# Altium project Strain Gauges OpAmps.PrjPcb
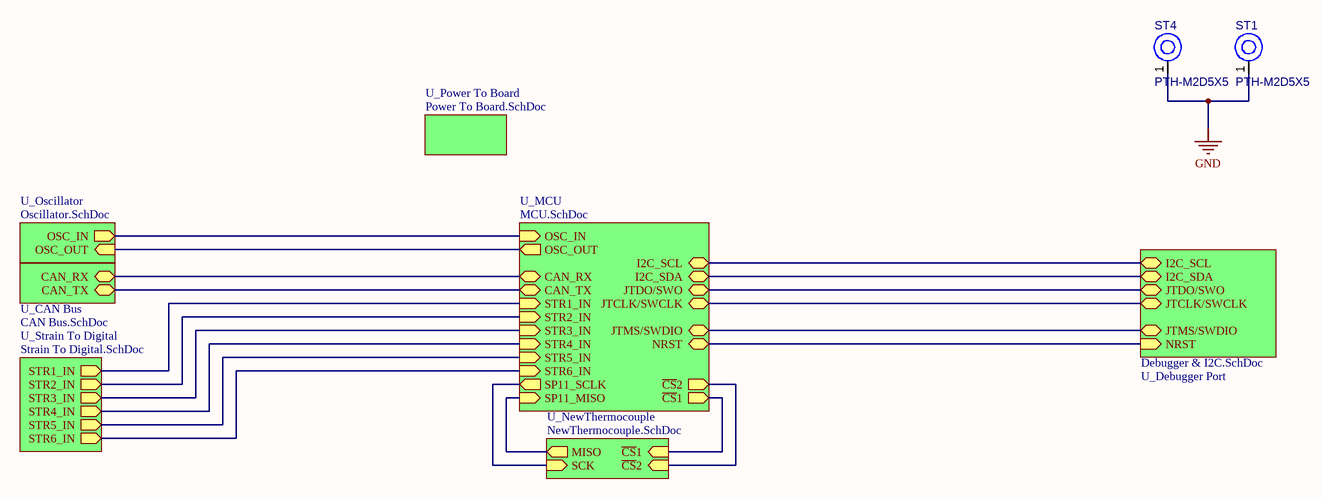
[diagram p0: Top.SchDoc]
9 sheets, 109 parts. Net scope: hierarchical (ports join the sheet entries above them; power ports are global).
Board file: Strain.PcbDoc
Sheets:
  Top.SchDoc
    U_Power To Board = Power To Board.SchDoc
    U_MCU = MCU.SchDoc
    U_Oscillator = Oscillator.SchDoc
    U_CAN Bus = CAN Bus.SchDoc
    U_Debugger Port = Debugger & I2C.SchDoc
    U_Strain To Digital = Strain To Digital.SchDoc
      U_Strain In = Strain In.SchDoc
    U_NewThermocouple = NewThermocouple.SchDoc

## Sheet Top.SchDoc
size A4; SheetNumber: 2; SheetTotal: 10

### Parts
ST1  PTH-M2D5X5  [PTH-M2D5X5]
ST4  PTH-M2D5X5  [PTH-M2D5X5]

### Sub-sheets
U_CAN Bus = CAN Bus.SchDoc: CAN_RX (bidir), CAN_TX (bidir)
U_Debugger Port = Debugger & I2C.SchDoc: JTDO/SWO (bidir), JTCLK/SWCLK (bidir), JTMS/SWDIO (bidir), NRST (in), I2C_SDA (bidir), I2C_SCL (bidir)
U_MCU = MCU.SchDoc: I2C_SDA (bidir), I2C_SCL (bidir), JTMS/SWDIO (bidir), JTCLK/SWCLK (bidir), JTDO/SWO (bidir), NRST (bidir), OSC_OUT (out), OSC_IN (in), SP11_SCLK (out), SP11_MISO (in), CAN_RX (bidir), CAN_TX (bidir), STR2_IN (in), STR3_IN (in), STR5_IN (in), STR1_IN (in), STR6_IN (in), STR4_IN (in), ~{CS}2 (out), ~{CS}1 (out)
U_NewThermocouple = NewThermocouple.SchDoc: ~{CS}1 (in), ~{CS}2 (in), MISO (out), SCK (in)
U_Oscillator = Oscillator.SchDoc: OSC_IN (out), OSC_OUT (in)
U_Power To Board = Power To Board.SchDoc: no entries
U_Strain To Digital = Strain To Digital.SchDoc: STR1_IN (out), STR2_IN (out), STR4_IN (out), STR5_IN (out), STR3_IN (out), STR6_IN (out)

### Nets
GND: ST1.1(H1) ST4.1(H1)
~{CS}1: sheet U_MCU/~{CS}1, sheet U_NewThermocouple/~{CS}1
~{CS}2: sheet U_MCU/~{CS}2, sheet U_NewThermocouple/~{CS}2
CAN_RX: sheet U_MCU/CAN_RX, sheet U_CAN Bus/CAN_RX
CAN_TX: sheet U_MCU/CAN_TX, sheet U_CAN Bus/CAN_TX
I2C_SCL: sheet U_MCU/I2C_SCL, sheet U_Debugger Port/I2C_SCL
I2C_SDA: sheet U_MCU/I2C_SDA, sheet U_Debugger Port/I2C_SDA
JTCLK/SWCLK: sheet U_MCU/JTCLK/SWCLK, sheet U_Debugger Port/JTCLK/SWCLK
JTDO/SWO: sheet U_MCU/JTDO/SWO, sheet U_Debugger Port/JTDO/SWO
JTMS/SWDIO: sheet U_MCU/JTMS/SWDIO, sheet U_Debugger Port/JTMS/SWDIO
MISO: sheet U_MCU/SP11_MISO, sheet U_NewThermocouple/MISO
NRST: sheet U_MCU/NRST, sheet U_Debugger Port/NRST
OSC_IN: sheet U_MCU/OSC_IN, sheet U_Oscillator/OSC_IN
OSC_OUT: sheet U_MCU/OSC_OUT, sheet U_Oscillator/OSC_OUT
SCK: sheet U_MCU/SP11_SCLK, sheet U_NewThermocouple/SCK
STR1_IN: sheet U_MCU/STR1_IN, sheet U_Strain To Digital/STR1_IN
STR2_IN: sheet U_MCU/STR2_IN, sheet U_Strain To Digital/STR2_IN
STR3_IN: sheet U_MCU/STR3_IN, sheet U_Strain To Digital/STR3_IN
STR4_IN: sheet U_MCU/STR4_IN, sheet U_Strain To Digital/STR4_IN
STR5_IN: sheet U_MCU/STR5_IN, sheet U_Strain To Digital/STR5_IN
STR6_IN: sheet U_MCU/STR6_IN, sheet U_Strain To Digital/STR6_IN

### Library data of the parts
ST1 ST4 = CMP-00028-00004-1: M2 PTH (2.5mm), 5mm pad; Pins: 1

## Sheet Power To Board.SchDoc
size A4; SheetNumber: 6; SheetTotal: 9
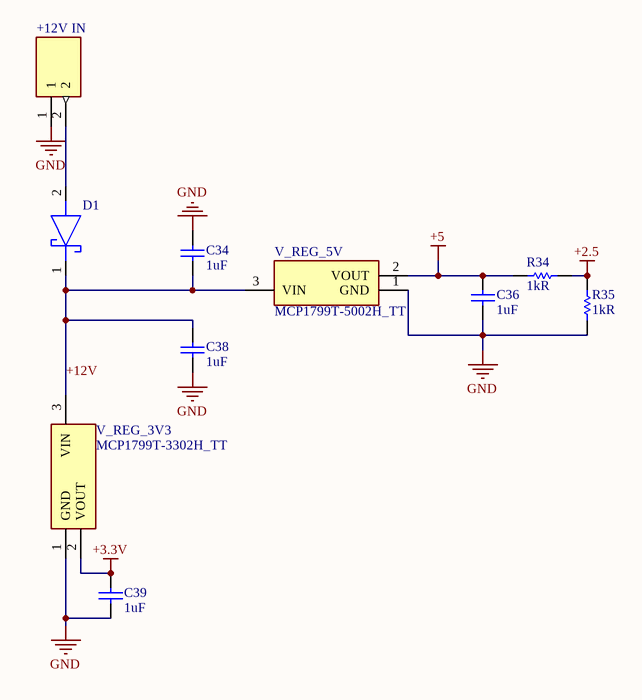
[diagram p1: Power To Board.SchDoc]

### Parts
+12V_IN  39773-0002  [397730002]  (value not drawn)
C34  1uF  [CAPC1608X90X35LL15T15]
C36  1uF  [CAPC1608X90X35LL15T15]
C38  1uF  [CAPC1608X90X35LL15T15]
C39  1uF  [CAPC1608X90X35LL15T15]
D1  NSR20F20NXT5G  [NSR20F20NXT5G]  (value not drawn)
R34  1kR  [RESC1608X55X30LL15T15]
R35  1kR  [RESC1608X55X30LL15T15]
V_REG_3V3  MCP1799T-3302H_TT  [SOT95P237X112-3N]
V_REG_5V  MCP1799T-5002H_TT  [SOT95P237X112-3N]

### Nets
+2.5: R34.1 R35.1
+3.3V: C39.2 V_REG_3V3.2(VOUT)
+5: C36.2 R34.2 V_REG_5V.2(VOUT)
GND: +12V_IN.1 C34.2 C36.1 C38.1 C39.1 R35.2 V_REG_3V3.1(GND) V_REG_5V.1(GND)
+12V: C34.1 C38.2 D1.1(K) V_REG_3V3.3(VIN) V_REG_5V.3(VIN)
Net+12V_IN_2: +12V_IN.2 D1.2(A)

### Library data of the parts
+12V_IN = 39773-0002: Connector; Manufacturer_Name: Molex; Datasheet Link: https://www.mouser.in/datasheet/2/276/2/397730002_sd-1378779.pdf; Height: 10.1mm; Manufacturer_Part_Number: 39773-0002
C34 C36 C38 C39 = CMP-2006-02298-2: Manufacturer: Kemet; Part Number: C0603C105K4RACTU
D1 = NSR20F20NXT5G: Schottky Diode; Manufacturer_Name: ON Semiconductor; Datasheet Link: https://www.onsemi.com/pdf/datasheet/nsr20f20-d.pdf; Height: 0.31mm; Manufacturer_Part_Number: NSR20F20NXT5G
R34 R35 = CMP-2000-00180-1: Part Number: ERJ-3EKF1001V; Manufacturer: Panasonic
V_REG_3V3 = MCP1799T-3302H_TT: Power Supply; Manufacturer_Name: Microchip; Manufacturer_Part_Number: MCP1799T-3302H/TT; Datasheet Link: https://ms.componentsearchengine.com/Datasheets/1/MCP1799T-3302H_TT.pdf; Height: 1.12mm
V_REG_5V = MCP1799T-5002H_TT: Integrated Circuit; Manufacturer_Name: Microchip; Manufacturer_Part_Number: MCP1799T-5002H/TT; Datasheet Link: https://www.arrow.com/en/products/mcp1799t-5002htt/microchip-technology; Height: 1.12mm

## Sheet MCU.SchDoc
size A4; SheetNumber: 4; SheetTotal: 9
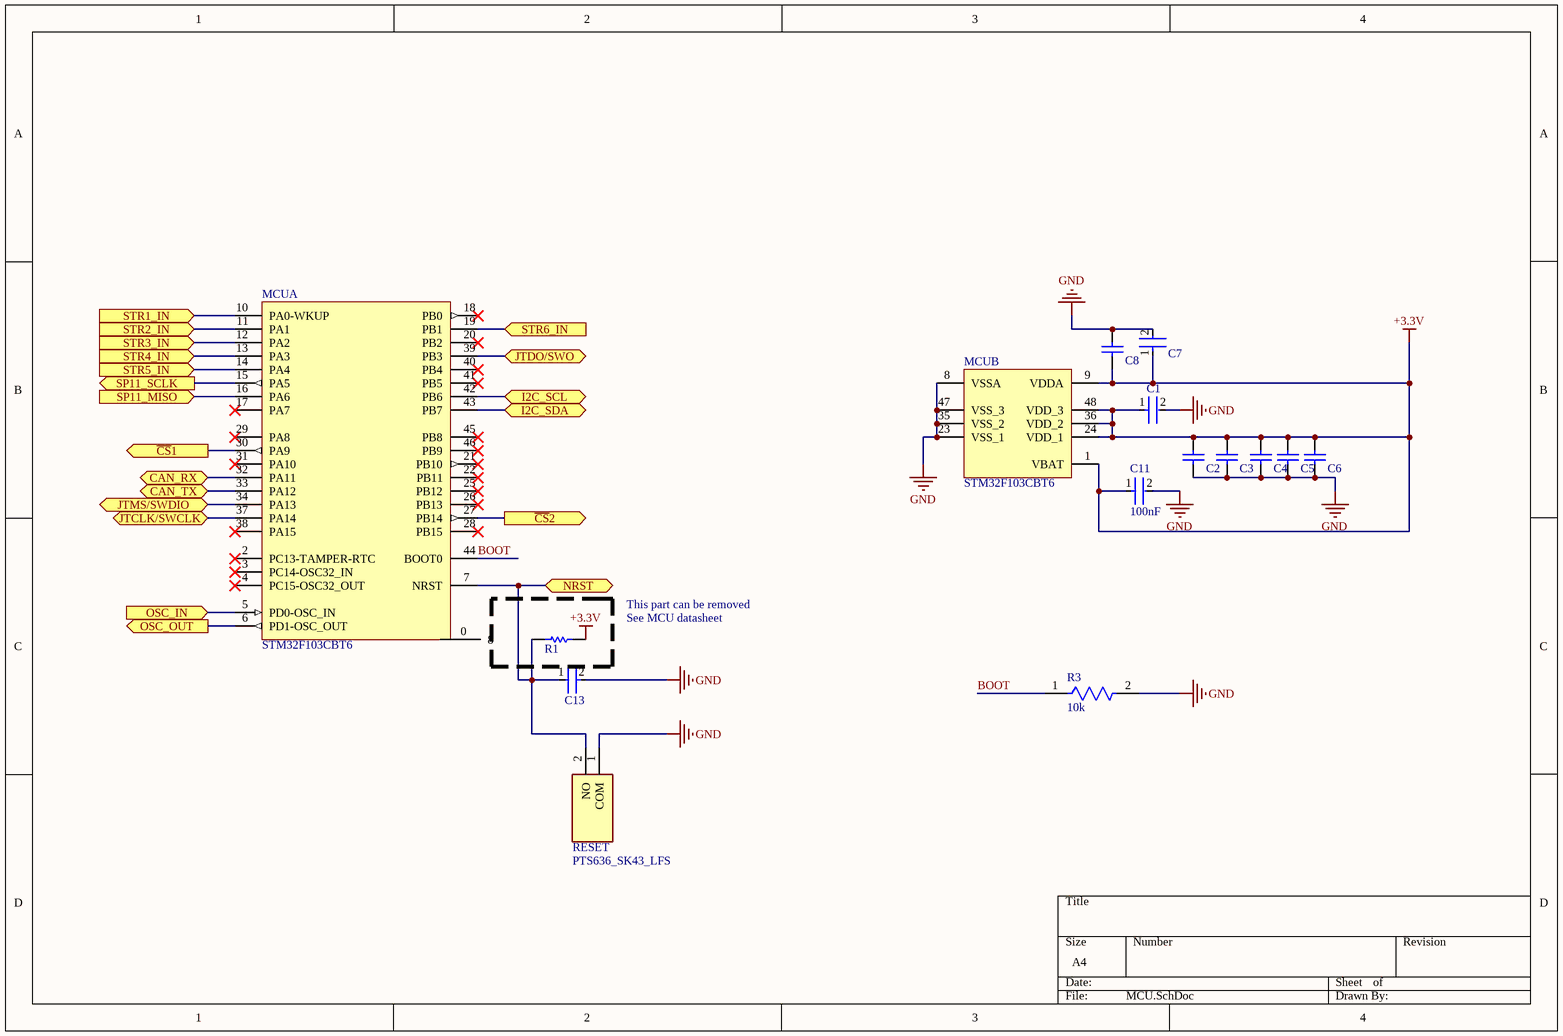
[diagram p2: MCU.SchDoc]

### Parts
C1  GRM155R60J475ME47D  [FP-GRM155-0_1-IPC_B]  (value not drawn)
C2  08051C104KAT2A  [CAPC2013X94X50ML20T25]  (value not drawn)
C3  08051C104KAT2A  [CAPC2013X94X50ML20T25]  (value not drawn)
C4  08051C104KAT2A  [CAPC2013X94X50ML20T25]  (value not drawn)
C5  08051C104KAT2A  [CAPC2013X94X50ML20T25]  (value not drawn)
C6  08051C104KAT2A  [CAPC2013X94X50ML20T25]  (value not drawn)
C7  GRM155R61A105KE15D  [FP-GRM15-0_1-MFG]  (value not drawn)
C8  08051C104KAT2A  [CAPC2013X94X50ML20T25]  (value not drawn)
C11  100nF  [FP-C0402-BB-MFG]
C13  GRM155R71C104KA88D  [FP-GRM15-MFG]  (value not drawn)
MCU  STM32F103CBT6  [STM-LQFP48_L]  (parts A,B of 2)
R1  CRCW12064K70FKEA  [RESC3216X60X45ML15T20]  (value not drawn)
R3  10k  [FP-CRCW0402-e3-IPC_B]
RESET  PTS636_SK43_LFS  [PTS636SK43LFS]

### Ports
CAN_RX (bidir), CAN_TX (bidir), I2C_SCL (bidir), I2C_SDA (bidir), JTCLK/SWCLK (bidir), JTDO/SWO (bidir), JTMS/SWDIO (bidir), NRST (bidir), OSC_IN (in), OSC_OUT (out), SP11_MISO (in), SP11_SCLK (out), STR1_IN (in), STR2_IN (in), STR3_IN (in), STR4_IN (in), STR5_IN (in), STR6_IN (in), ~{CS}1 (out), ~{CS}2 (out)

### Nets
+3.3V: C1.1 C2.2 C3.2 C4.2 C5.2 C6.2 C7.1 C8.2 C11.1 MCU.1(VBAT) MCU.9(VDDA) MCU.24(VDD_1) MCU.36(VDD_2) MCU.48(VDD_3) R1.2
GND: C1.2 C2.1 C3.1 C4.1 C5.1 C6.1 C7.2 C8.1 C11.2 C13.2 MCU.8(VSSA) MCU.23(VSS_1) MCU.35(VSS_2) MCU.47(VSS_3) R3.2 RESET.1(COM)
~{CS}1: MCU.30(PA9) ; port ~{CS}1
~{CS}2: MCU.27(PB14) ; port ~{CS}2
BOOT: MCU.44(BOOT0) R3.1
CAN_RX: MCU.32(PA11) ; port CAN_RX
CAN_TX: MCU.33(PA12) ; port CAN_TX
I2C_SCL: MCU.42(PB6) ; port I2C_SCL
I2C_SDA: MCU.43(PB7) ; port I2C_SDA
JTCLK/SWCLK: MCU.37(PA14) ; port JTCLK/SWCLK
JTDO/SWO: MCU.39(PB3) ; port JTDO/SWO
JTMS/SWDIO: MCU.34(PA13) ; port JTMS/SWDIO
MISO: MCU.16(PA6) ; port SP11_MISO
NRST: C13.1 MCU.7(NRST) R1.1 RESET.2(NO) ; port NRST
OSC_IN: MCU.5(PD0-OSC_IN) ; port OSC_IN
OSC_OUT: MCU.6(PD1-OSC_OUT) ; port OSC_OUT
SCK: MCU.15(PA5) ; port SP11_SCLK
STR1_IN: MCU.10(PA0-WKUP) ; port STR1_IN
STR2_IN: MCU.11(PA1) ; port STR2_IN
STR3_IN: MCU.12(PA2) ; port STR3_IN
STR4_IN: MCU.13(PA3) ; port STR4_IN
STR5_IN: MCU.14(PA4) ; port STR5_IN
STR6_IN: MCU.19(PB1) ; port STR6_IN

Not connected (* = marked no-connect by the designer): MCU 0(8) 2(PC13-TAMPER-RTC)* 3(PC14-OSC32_IN)* 4(PC15-OSC32_OUT)* 17(PA7)* 18(PB0)* 20(PB2)* 21(PB10)* 22(PB11)* 25(PB12)* 26(PB13)* 28(PB15)* 29(PA8)* 31(PA10)* 38(PA15)* 40(PB4)* 41(PB5)* 45(PB8)* 46(PB9)*

### Notes on the sheet
- This part can be removed
- See MCU datasheet

### Library data of the parts
C1 = CMP-2008-04549-2: Chip Multilayer Ceramic Capacitors for General Purpose, 0402, 4.7uF, X5R, 15%, 20%, 6.3V; Height: 0.5mm; Weight: 0.000212oz; Length: 1mm; Case Code (Metric): 1005; Packaging: Tape and Reel; Termination: SMD/SMT; Dielectric: X5R; Depth: 0.5mm; Case Code (Imperial): 0402; Min Operating Temperature: -55°C; Case/Package: 0402; Voltage: 6.3V; Width: 0.02inch; Capacitance: 4.7uF; Lead Free: Lead Free; Thickness: 0.022inch; Contact Plating: Tin; REACH SVHC: No SVHC; Package Quantity: 10000; Tolerance: 20%; Voltage Rating (DC): 6.3V; Voltage Rating: 6.3V; Mount: Surface Mount; Max Operating Temperature: 85°C
C2-C6 C8 = CMP-2007-04174-1: Manufacturer: AVX Interconnect / Elco; Part Number: 08051C104KAT2A
C7 = CMP-2008-04556-2: CAP CER 1UF 10V X5R 0402; Manufacturer: Murata; Material: Ceramic; Tolerance: 10%; Temperature Coefficient: 15%; Octopart: https://octopart.com/grm155r61a105ke15d-murata-197442; Manufacturer Part Number: GRM155R61A105KE15D; Lead Free: Yes; ComponentLink2Description: Datasheet; Temperature: -55°C to +85°C; Temperature Range High: +85°C; Height: 0.55mm; Capacitance: 1uF; Ipc Land Pattern Name: CAPC10050X50; ComponentLink2URL: https://search.murata.co.jp/Ceramy/image/img/A01X/G101/ENG/GRM155R61A105KE15-01A.pdf; Temperature Range Low: -55°C; Device Class L2: Capacitors; Voltage Rating: 10V; RoHS: TRUE; Device Class L1: Passive Components; Device Class L3: Ceramic Capacitors; Temperature Characteristic: X5R; Mouser Description: 0402 1 uF 10 V ±10% Tolerance X5R Surface Mount Multilayer Ceramic Capacitor; Automotive: No; Package: GRM15-0.1; Digikey Description: CAP CER 1UF 10V X5R 0402; Value: 1uF; Category: Cap
C11 = CMP-2008-02046-2: CAP CER 0.1UF 10V X5R 0402; Manufacturer: Kemet; Manufacturer Part Number: C0402C104K8PACTU; Material: Ceramic; Capacitance: 0.10 μF; Temperature Coefficient: 15%; Tolerance: 0.1; Value: 0.10 μF; Package: C0402-BB; Temperature: -55°C to +125°C; ComponentLink2Description: Datasheet; Temperature Characteristic: X5R; Device Class L1: Passive Components; Height: 0.55mm; Lead Free: Yes; ComponentLink2URL: https://content.kemet.com/datasheets/KEM_C1002_X7R_SMD.pdf; Device Class L2: Capacitors; Temperature Range Low: -55°C; Temperature Range High: +125°C; RoHS: TRUE; Octopart: https://octopart.com/c0402c104k8pactu-kemet-140039; Automotive: No; Mouser Description: Capacitor 100 nF 10 VDC 0402; Category: Cap; Voltage Rating: 10 V; Digikey Description: CAP CER 0.1UF 10V X5R 0402; Ipc Land Pattern Name: CAPC10050X50; Device Class L3: Ceramic Capacitors
C13 = CMP-2100-03641-2: CAP CER 0.1UF 16V X7R 0402; Manufacturer: Murata; Standoff Height: 0mm; Tolerance: 10%; Voltage Rating: 16Vdc; Material: Ceramic; Capacitance: 0.10μF; Value: 0.10μF; RoHS: TRUE; Manufacturer Part Number: GRM155R71C104KA88D; Temperature Characteristic: X7R; Octopart: https://octopart.com/grm155r71c104ka88d-murata-196880; Digikey Description: CAP CER 0.1UF 16V X7R 0402; Device Class L3: Ceramic Capacitors; Height: 0.55mm; ComponentLink2Description: Datasheet; Temperature Range Low: -55°C; Ipc Land Pattern Name: CAPC10050X219; ComponentLink2URL: https://search.murata.co.jp/Ceramy/image/img/A01X/G101/ENG/GRM155R71H471KA01-01A.pdf; Device Class L1: Passive Components; Lead Free: yes; Category: Cap; Package: GRM15; Temperature: -55°C to +125°C; Device Class L2: Capacitors; Temperature Range High: +125°C; Mouser Description: 0402 0.1 uF 16V ±10 % Tolerance X7R SMT Multilayer Ceramic Capacitor
MCU = CMP-0237-00250-3: ARM Cortex-M3 32-bit MCU, 128 KB Flash, 20 KB Internal RAM, 37 I/Os, 48-pin LQFP, -40 to 85 degC, Tray; Supply Voltage(Vcc) min (V): 2; Operating Frequency(F) (Processor speed) (MHz): 72; A/D Converter: 2x12-bit (10 Channel); FLASH Size (Prog) (kB): 128; Internal RAM Size (kB): 20; I/Os (High Current): 37; ComponentLink2Description: Datasheet; PackageReference: LQFP48; PartNumber: STM32F103CBT6; ComponentLink1Description: Manufacturer URL; DatasheetVersion: Rev. 16; PackageVersion: Rev. 6, 06/2013; Packing: Tray; ComponentLink1URL: http://www.st.com/web/en/home.html; Mounting Technology: Surface Mount; ComponentLink3URL: http://www.st.com/st-web-ui/static/active/en/resource/technical/document/datasheet/DM00058181.pdf; PackageDescription: 48-Pin Low Profile Quad Flat Package, 7 x 7 mm Body, 0.5 mm Pitch; Core: ARM Cortex-M3; ComponentLink3Description: Package Specification; ComponentLink2URL: http://www.st.com/st-web-ui/static/active/en/resource/technical/document/datasheet/CD00161566.pdf
R1 = CMP-2100-03618-1: Chip Resistor, 4.7 KOhm, +/- 1%, 0.25 W, -55 to 155 degC, 1206 (3216 Metric), RoHS, Tape and Reel; Manufacturer: Vishay Semiconductor; Power Rating: 250mW; Voltage Rating: 200V; Temperature Coefficient: 100ppm/degreesC; Package Quantity: 10; Composition: ThickFilm; REACH SVHC: Unknown; Mount: SurfaceMount; Max Operating Temperature: 155degC; Length: 3.2mm; Number of Terminations: 2; Case Code (Metric): 3216; Military Standard: Not; Width: 1.6mm; Datasheet Version: 41061.0; Max Power Dissipation: 250mW; Datasheet URL: http://www.vishay.com/docs/20035/dcrcwe3.pdf; Contact Plating: Tin; Case/Package: 1206; Height: 0.55mm; Package Reference: 1206.0; Lead Free: LeadFree; Weight: 0.000353oz; Package Description: 2-Pin Surface Mount Device, Body 3.15 x 1.6 mm; Min Operating Temperature: -55degC; Resistance: 4.7KOhm; Packaging: TapeandReel; Depth: 1.6mm; Tolerance: 1%; RoHSCompliant: true; Termination: SMD/SMT; Case Code (Imperial): 1206; Voltage Rating (DC): 200V; Radiation Hardening: No; Manufacturer URL: http://www.vishay.com/
R3 = CMP-2002-08135-2: RES SMD 10K OHM 1% 1/16W 0402; Power Rating: 63mW; Resistance: 10kR; Voltage Rating: 50V; Temperature Coefficient: 100ppm/°C; Case Code (Metric): 1005; Features: Automotive AEC-Q200; Termination: SMD/SMT; Mount: Surface Mount; Package Quantity: 10; Packaging: Tape and Reel; Case Code (Imperial): 0402; Weight: 2.3E-05oz; Lead Free: Lead Free; Width: 0.02inch; Max Power Dissipation: 63mW; Tolerance: 1%; Number of Terminations: 2; Height: 0.35mm; Number of Pins: 2; Composition: Thick Film; Length: 1mm; Voltage Rating (DC): 50V; Case/Package: 0402; Radiation Hardening: No; Contact Plating: Tin; Depth: 0.5mm; Military Standard: Not; Min Operating Temperature: -55°C; Max Operating Temperature: 155°C
RESET = PTS636_SK43_LFS: Switch; Manufacturer_Name: C & K COMPONENTS; Manufacturer_Part_Number: PTS636 SK43 LFS; Datasheet Link: https://componentsearchengine.com/Datasheets/1/PTS636 SK43 LFS.pdf; Height: 4.5mm

## Sheet Oscillator.SchDoc
size A4; SheetNumber: 4; SheetTotal: 9
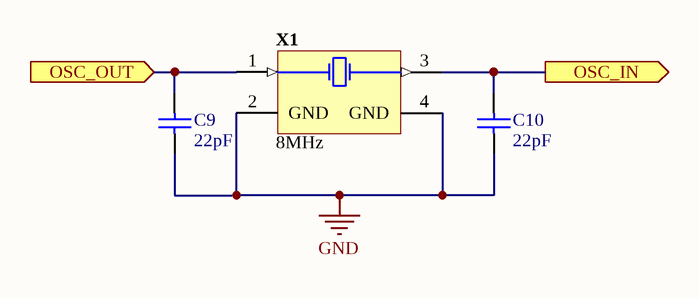
[diagram p3: Oscillator.SchDoc]

### Parts
C9  22pF  [CAPC1608X90X35ML10T15]
C10  22pF  [CAPC1608X90X35ML10T15]
X1  8MHz  [ABRA-ABM3B_V]

### Ports
OSC_IN (out), OSC_OUT (in)

### Nets
GND: C9.1 C10.1 X1.2(GND) X1.4(GND)
OSC_IN: C10.2 X1.3(X2) ; port OSC_IN
OSC_OUT: C9.2 X1.1(X1) ; port OSC_OUT

### Library data of the parts
C9 C10 = CMP-2000-04945-1: Chip Capacitor, 22 pF, +/- 5%, 50 V, -55 to 125 degC, 0603 (1608 Metric), RoHS, Tape and Reel; Manufacturer: Murata; Rated Voltage: 50V; Dielectric: C0G; Capacitance: 22pF; Manufacturer URL: http://www.murata.com/; Datasheet Version: Jul-06; Package Reference: 603; Tolerance (%): ±5%; Case Size/Dimension: 0603; Package Description: 2-Pin Surface Mount Device, Body 1.6 x 0.8 mm; Datasheet URL: https://datasheet.ciiva.com/11786/0900766b807a1cab-11786398.pdf
X1 = CMP-1688-00002-1: Ceramic SMD Crystal, 8 MHz, +/- 20 ppm, 200 Ohm, -20 to 70 degC, 4-Pin SMD, RoHS, Tape and Reel; Max Supply Voltage: 45 V; Outputs: 4; Min Supply Voltage: 8.2 V; Output Voltage: 3.3 V; Switching Frequency: 30 KHz; Output Current: 1.8 A; Packaging: Rail/Tube; ComponentLink2Description: Datasheet; REACH SVHC: No SVHC; ComponentLink1URL: http://www.abracon.com/; PackageReference: ABM3B; Weight: 0.004233 oz; Height: 1.05 mm; ComponentLink2URL: http://www.abracon.com/Resonators/abm3b.pdf; Mount: Surface Mount; Min Operating Temperature: -40 degC; Max Operating Temperature: 85 degC; Package Quantity: 50; PackageDescription: 4-Pin Surface Mount Device, Body 5 x 3.2 mm; Pins: 28; DatasheetVersion: Aug-15; ComponentLink1Description: Manufacturer URL; RoHSCompliant: true; Radiation Hardening: No; Length: 9.8 mm; Width: 4.5 mm

## Sheet CAN Bus.SchDoc
size A4; SheetNumber: 5; SheetTotal: 9
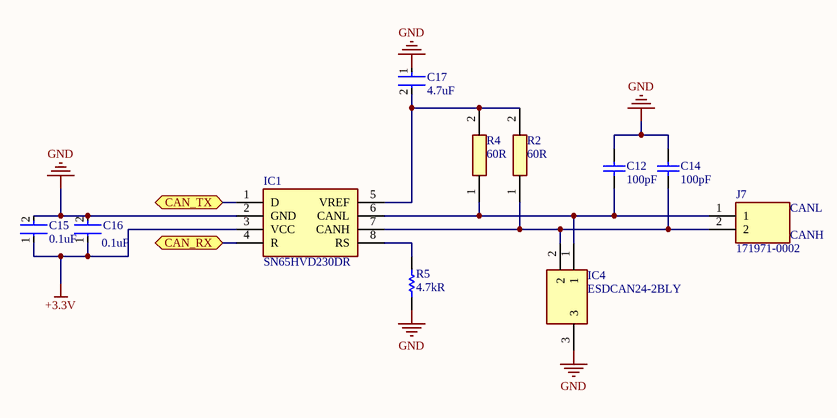
[diagram p4: CAN Bus.SchDoc]

### Parts
C12  100pF  [CAPC1608X90X35NL10T15]
C14  100pF  [CAPC1608X90X35NL10T15]
C15  0.1uF  [FP-GRM15-MFG]
C16  0.1uF  [FP-GRM15-MFG]
C17  4.7uF  [FP-GRM155-0_1-IPC_B]
IC1  SN65HVD230DR  [SOT127P600X175-8N]
IC4  ESDCAN24-2BLY  [SOT105P255X150-3N]
J7  171971-0002  [SHDR2W65P0X254_1X2_738X510X1216P]
R2  60R  [RESC3216X60N]
R4  60R  [RESC3216X60N]
R5  4.7kR  [RESC3216X60X45ML15T20]

### Ports
CAN_RX (bidir), CAN_TX (bidir)

### Nets
+3.3V: C15.1 C16.1 IC1.3(VCC)
GND: C12.2 C14.2 C15.2 C16.2 C17.1 IC1.2(GND) IC4.3 R5.1
CAN_RX: IC1.4(R) ; port CAN_RX
CAN_TX: IC1.1(D) ; port CAN_TX
NetC12_1: C12.1 IC1.6(CANL) IC4.1 J7.1 R4.1
NetC14_1: C14.1 IC1.7(CANH) IC4.2 J7.2 R2.1
NetC17_2: C17.2 IC1.5(VREF) R2.2 R4.2
NetIC1_8: IC1.8(RS) R5.2

### Notes on the sheet
- CANL
- CANH

### Library data of the parts
C12 C14 = CMP-2006-02595-1: Part Number: GRM1885C1H101JA01D; Manufacturer: Murata
C15 C16 = CMP-2100-03641-2: CAP CER 0.1UF 16V X7R 0402; Manufacturer Part Number: GRM155R71C104KA88D; Manufacturer: Murata; Standoff Height: 0mm; Tolerance: 10%; Voltage Rating: 16Vdc; Material: Ceramic; Capacitance: 0.10μF; Value: 0.10μF; RoHS: TRUE; Temperature Characteristic: X7R; Octopart: https://octopart.com/grm155r71c104ka88d-murata-196880; Digikey Description: CAP CER 0.1UF 16V X7R 0402; Device Class L3: Ceramic Capacitors; Height: 0.55mm; ComponentLink2Description: Datasheet; Temperature Range Low: -55°C; Ipc Land Pattern Name: CAPC10050X219; ComponentLink2URL: https://search.murata.co.jp/Ceramy/image/img/A01X/G101/ENG/GRM155R71H471KA01-01A.pdf; Device Class L1: Passive Components; Lead Free: yes; Category: Cap; Package: GRM15; Temperature: -55°C to +125°C; Device Class L2: Capacitors; Temperature Range High: +125°C; Mouser Description: 0402 0.1 uF 16V ±10 % Tolerance X7R SMT Multilayer Ceramic Capacitor
C17 = CMP-2008-04549-2: as C1 on sheet MCU; Height: 0.5mm; Weight: 0.000212oz; Length: 1mm; Case Code (Metric): 1005; Packaging: Tape and Reel; Termination: SMD/SMT; Dielectric: X5R; Depth: 0.5mm; Case Code (Imperial): 0402; Min Operating Temperature: -55°C; Case/Package: 0402; Voltage: 6.3V; Width: 0.02inch; Capacitance: 4.7uF; Lead Free: Lead Free; Thickness: 0.022inch; Contact Plating: Tin; REACH SVHC: No SVHC; Package Quantity: 10000; Tolerance: 20%; Voltage Rating (DC): 6.3V; Voltage Rating: 6.3V; Mount: Surface Mount; Max Operating Temperature: 85°C
IC1 = SN65HVD230DR: Integrated Circuit; Manufacturer_Name: Texas Instruments; Datasheet Link: http://www.ti.com/lit/gpn/sn65hvd230; Height: 1.75mm; Mouser2 Part Number: 595-SN65HVD230DR; Mouser2 Price/Stock: https://www.mouser.com/Search/Refine.aspx?Keyword=595-SN65HVD230DR; Manufacturer_Part_Number: SN65HVD230DR
IC4 = ESDCAN24-2BLY: Integrated Circuit; Manufacturer_Name: STMicroelectronics; Datasheet Link: https://componentsearchengine.com//ESDCAN24-2BLY.pdf; Height: 1.5mm; Mouser2 Part Number: 511-ESDCAN24-2BLY; Mouser2 Price/Stock: https://www.mouser.com/Search/Refine.aspx?Keyword=511-ESDCAN24-2BLY; Manufacturer_Part_Number: ESDCAN24-2BLY
J7 = 171971-0002: Connector; Manufacturer_Name: Molex; Datasheet Link: https://componentsearchengine.com//171971-0002.pdf; Height: 12.16mm; Mouser2 Part Number: 538-171971-0002; Mouser2 Price/Stock: https://www.mouser.com/Search/Refine.aspx?Keyword=538-171971-0002; Manufacturer_Part_Number: 171971-0002
R2 R4 = CRCW120660R0KNEAIF: Resistor; Manufacturer_Name: Vishay; Datasheet Link: http://componentsearchengine.com/Datasheets/1/CRCW120660R0KNEAIF.pdf; Height: 0.6mm; Manufacturer_Part_Number: CRCW120660R0KNEAIF
R5 = CMP-2100-03618-1: as R1 on sheet MCU; Package Quantity: 10; Composition: ThickFilm; REACH SVHC: Unknown; Mount: SurfaceMount; Max Operating Temperature: 155degC; Length: 3.2mm; Number of Terminations: 2; Case Code (Metric): 3216; Military Standard: Not; Width: 1.6mm; Datasheet Version: 41061.0; Max Power Dissipation: 250mW; Datasheet URL: http://www.vishay.com/docs/20035/dcrcwe3.pdf; Contact Plating: Tin; Case/Package: 1206; Height: 0.55mm; Package Reference: 1206.0; Lead Free: LeadFree; Weight: 0.000353oz; Package Description: 2-Pin Surface Mount Device, Body 3.15 x 1.6 mm; Min Operating Temperature: -55degC; Resistance: 4.7KOhm; Packaging: TapeandReel; Depth: 1.6mm; Tolerance: 1%; RoHSCompliant: true; Termination: SMD/SMT; Case Code (Imperial): 1206; Voltage Rating (DC): 200V; Radiation Hardening: No; Manufacturer URL: http://www.vishay.com/

## Sheet Debugger & I2C.SchDoc
size A4; SheetNumber: 6; SheetTotal: 9
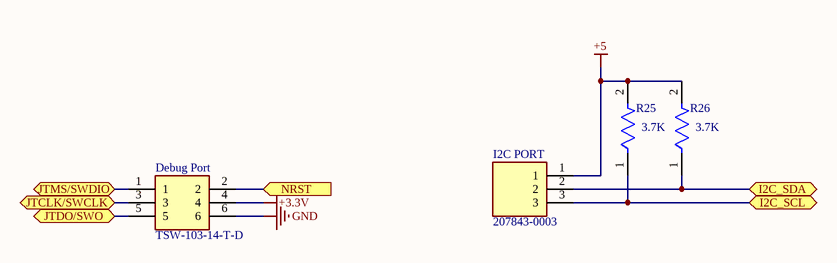
[diagram p5: Debugger & I2C.SchDoc]

### Parts
Debug_Port  TSW-103-14-T-D  [TSW-103-XX-YY-D]
I2C_PORT  207843-0003  [2078430003]
R25  3.7K  [FP-RN731J-MFG]
R26  3.7K  [FP-RN731J-MFG]

### Ports
I2C_SCL (bidir), I2C_SDA (bidir), JTCLK/SWCLK (bidir), JTDO/SWO (bidir), JTMS/SWDIO (bidir), NRST (in)

### Nets
+3.3V: Debug_Port.4
+5: I2C_PORT.1 R25.2 R26.2
GND: Debug_Port.6
I2C_SCL: I2C_PORT.3 R25.1 ; port I2C_SCL
I2C_SDA: I2C_PORT.2 R26.1 ; port I2C_SDA
JTCLK/SWCLK: Debug_Port.3 ; port JTCLK/SWCLK
JTDO/SWO: Debug_Port.5 ; port JTDO/SWO
JTMS/SWDIO: Debug_Port.1 ; port JTMS/SWDIO
NRST: Debug_Port.2 ; port NRST

### Library data of the parts
Debug_Port = TSW-103-14-T-D: Connector; Manufacturer_Name: SAMTEC; Datasheet Link: http://suddendocs.samtec.com/prints/tsw-xxx-xx-xxx-x-xx-xxx-mkt.pdf; Manufacturer_Part_Number: TSW-103-14-T-D
I2C_PORT = 207843-0003: Connector; Manufacturer_Name: Molex; Datasheet Link: https://www.molex.com/pdm_docs/sd/2078430003_sd.pdf; Height: 6.95mm; Manufacturer_Part_Number: 207843-0003
R25 R26 = CMP-04015-066978-1: 3.7kΩ ±0.25% 0.063W, 1/16W Chip Resistor 0603 (1608 Metric) Moisture Resistant Thin Film; Voltage Rating: 50V; Power Rating: 63mW; Temperature Coefficient: 10ppm/°C; Resistance: 3.7kR; Min Operating Temperature: -55°C; Packaging: Tape and Reel; Tolerance: 0.25%; Termination: SMD/SMT; Case/Package: 0603; Case Code (Metric): 1608; Case Code (Imperial): 0603; Composition: Thin Film; Max Operating Temperature: 125°C

## Sheet Strain To Digital.SchDoc
size A4; SheetNumber: 7; SheetTotal: 9
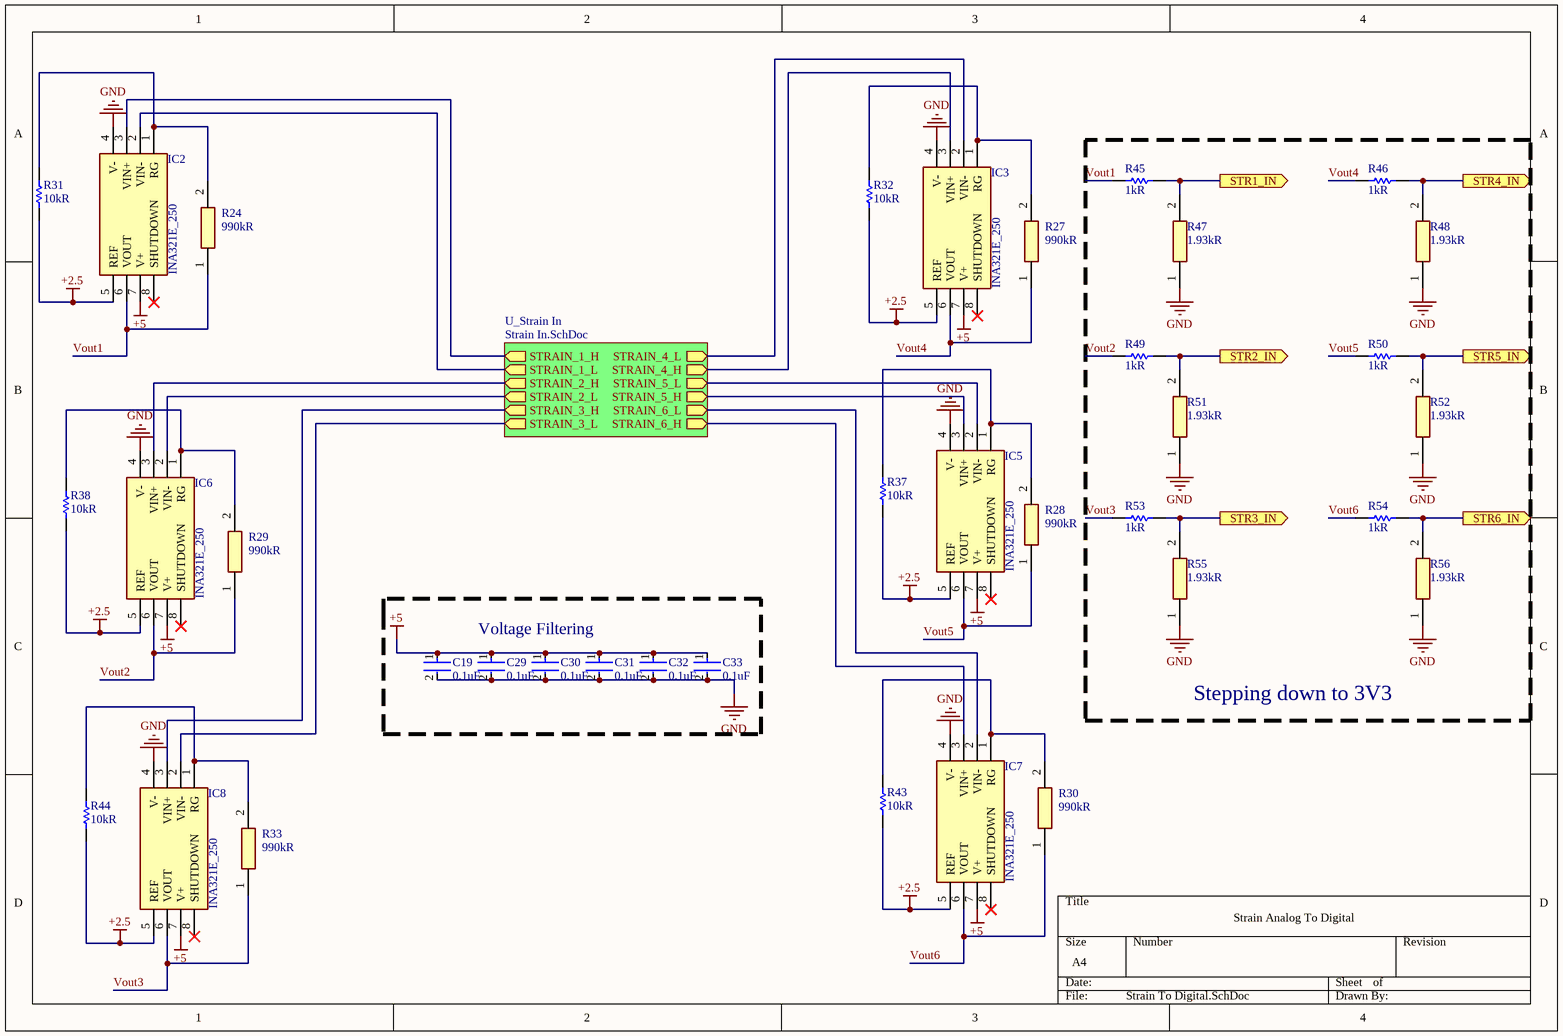
[diagram p6: Strain To Digital.SchDoc]

### Parts
C19  0.1uF  [FP-CC0402-MFG]
C29  0.1uF  [FP-CC0402-MFG]
C30  0.1uF  [FP-CC0402-MFG]
C31  0.1uF  [FP-CC0402-MFG]
C32  0.1uF  [FP-CC0402-MFG]
C33  0.1uF  [FP-CC0402-MFG]
IC2  INA321E_250  [SOP65P490X110-8N]
IC3  INA321E_250  [SOP65P490X110-8N]
IC5  INA321E_250  [SOP65P490X110-8N]
IC6  INA321E_250  [SOP65P490X110-8N]
IC7  INA321E_250  [SOP65P490X110-8N]
IC8  INA321E_250  [SOP65P490X110-8N]
R24  990kR  [RESC3216X84N]
R27  990kR  [RESC3216X84N]
R28  990kR  [RESC3216X84N]
R29  990kR  [RESC3216X84N]
R30  990kR  [RESC3216X84N]
R31  10kR  [RESC1608X55X30ML20T20]
R32  10kR  [RESC1608X55X30ML20T20]
R33  990kR  [RESC3216X84N]
R37  10kR  [RESC1608X55X30ML20T20]
R38  10kR  [RESC1608X55X30ML20T20]
R43  10kR  [RESC1608X55X30ML20T20]
R44  10kR  [RESC1608X55X30ML20T20]
R45  1kR  [RESC2013X50X30NL20T20]
R46  1kR  [RESC2013X50X30NL20T20]
R47  1.93kR  [TNPW04021K93BEED]
R48  1.93kR  [TNPW04021K93BEED]
R49  1kR  [RESC2013X50X30NL20T20]
R50  1kR  [RESC2013X50X30NL20T20]
R51  1.93kR  [TNPW04021K93BEED]
R52  1.93kR  [TNPW04021K93BEED]
R53  1kR  [RESC2013X50X30NL20T20]
R54  1kR  [RESC2013X50X30NL20T20]
R55  1.93kR  [TNPW04021K93BEED]
R56  1.93kR  [TNPW04021K93BEED]

### Blocks framed on the sheet
Stepping down to 3V3: R45-R56
Voltage Filtering: C19 C29-C33

### Sub-sheets
U_Strain In = Strain In.SchDoc: STRAIN_1_L (out), STRAIN_1_H (out), STRAIN_2_L (out), STRAIN_2_H (out), STRAIN_3_H (out), STRAIN_3_L (out), STRAIN_4_H (out), STRAIN_4_L (out), STRAIN_5_H (out), STRAIN_5_L (out), STRAIN_6_H (out), STRAIN_6_L (out)

### Ports
STR1_IN (out), STR2_IN (out), STR3_IN (out), STR4_IN (out), STR5_IN (out), STR6_IN (out)

### Nets
+2.5: IC2.5(REF) IC3.5(REF) IC5.5(REF) IC6.5(REF) IC7.5(REF) IC8.5(REF) R31.2 R32.2 R37.2 R38.2 R43.2 R44.2
+5: C19.1 C29.1 C30.1 C31.1 C32.1 C33.1 IC2.7(V+) IC3.7(V+) IC5.7(V+) IC6.7(V+) IC7.7(V+) IC8.7(V+)
GND: C19.2 C29.2 C30.2 C31.2 C32.2 C33.2 IC2.4(V-) IC3.4(V-) IC5.4(V-) IC6.4(V-) IC7.4(V-) IC8.4(V-) R47.1 R48.1 R51.1 R52.1 R55.1 R56.1
STR1_IN: R45.2 R47.2 ; port STR1_IN
STR2_IN: R49.2 R51.2 ; port STR2_IN
STR3_IN: R53.2 R55.2 ; port STR3_IN
STR4_IN: R46.2 R48.2 ; port STR4_IN
STR5_IN: R50.2 R52.2 ; port STR5_IN
STR6_IN: R54.2 R56.2 ; port STR6_IN
STRAIN_1_H: IC2.3(VIN+) ; sheet U_Strain In/STRAIN_1_H
STRAIN_1_L: IC2.2(VIN-) ; sheet U_Strain In/STRAIN_1_L
STRAIN_2_H: IC6.3(VIN+) ; sheet U_Strain In/STRAIN_2_H
STRAIN_2_L: IC6.2(VIN-) ; sheet U_Strain In/STRAIN_2_L
STRAIN_3_H: IC8.3(VIN+) ; sheet U_Strain In/STRAIN_3_H
STRAIN_3_L: IC8.2(VIN-) ; sheet U_Strain In/STRAIN_3_L
STRAIN_4_H: IC3.3(VIN+) ; sheet U_Strain In/STRAIN_4_H
STRAIN_4_L: IC3.2(VIN-) ; sheet U_Strain In/STRAIN_4_L
STRAIN_5_H: IC5.3(VIN+) ; sheet U_Strain In/STRAIN_5_H
STRAIN_5_L: IC5.2(VIN-) ; sheet U_Strain In/STRAIN_5_L
STRAIN_6_H: IC7.3(VIN+) ; sheet U_Strain In/STRAIN_6_H
STRAIN_6_L: IC7.2(VIN-) ; sheet U_Strain In/STRAIN_6_L
Vout1: IC2.6(VOUT) R24.1 R45.1
Vout2: IC6.6(VOUT) R29.1 R49.1
Vout3: IC8.6(VOUT) R33.1 R53.1
Vout4: IC3.6(VOUT) R27.1 R46.1
Vout5: IC5.6(VOUT) R28.1 R50.1
Vout6: IC7.6(VOUT) R30.1 R54.1
NetIC2_1: IC2.1(RG) R24.2 R31.1
NetIC3_1: IC3.1(RG) R27.2 R32.1
NetIC5_1: IC5.1(RG) R28.2 R37.1
NetIC6_1: IC6.1(RG) R29.2 R38.1
NetIC7_1: IC7.1(RG) R30.2 R43.1
NetIC8_1: IC8.1(RG) R33.2 R44.1

Not connected (* = marked no-connect by the designer): IC2 8(SHUTDOWN)*; IC3 8(SHUTDOWN)*; IC5 8(SHUTDOWN)*; IC6 8(SHUTDOWN)*; IC7 8(SHUTDOWN)*; IC8 8(SHUTDOWN)*

### Notes on the sheet
- Strain Analog To Digital

### Library data of the parts
C19 C29-C33 = CMP-03422-000048-1: CAP CER 0.1UF 16V X7R 0402; Manufacturer: YAGEO; Manufacturer Part Number: CC0402KRX7R7BB104; Material: Ceramic; Automotive Grade: NA; Capacitance: 100 nF; Temperature Coefficient: 30ppm/°C; Tolerance: 0.1; Value: 100 nF; Device Class L1: Passive Components; Temperature Range Low: -55°C; Device Class L3: Ceramic Capacitors; Temperature Characteristic: X7R; Ipc Land Pattern Name: CAPC10050X50; Temperature Range High: +125°C; Voltage Rating: 16 V; Temperature: -55°C to +125°C; RoHS: TRUE; Automotive: No; Height: 0.55mm; Device Class L2: Capacitors; Digikey Description: CAP CER 0.1UF 16V X7R 0402; Package: CC0402; Footprint Url: http://www.yageo.com/exep/pages/download/literatures/UPY-C_GEN_24.pdf; ComponentLink2Description: Datasheet; Category: Cap; Lead Free: Yes; Octopart: https://octopart.com/cc0402krx7r7bb104-yageo-42244624; ComponentLink2URL: http://www.yageo.com/documents/recent/UPY-GP_NP0_16V-to-50V_16.pdf; Mouser Description: 0402 0.1 uF 16 V ±10 % Tolerance X7R SMT Multilayer Ceramic Capacitor
IC2 IC3 IC5-IC8 = INA321E_250: Integrated Circuit; Manufacturer_Name: Texas Instruments; Manufacturer_Part_Number: INA321E/250; Datasheet Link: http://www.ti.com/lit/gpn/INA321; Height: 1.1mm
R24 R27-R30 R33 = PTN1206E9903BST1: Resistor; Manufacturer_Name: Vishay; Datasheet Link: http://www.vishay.com/docs/60026/ptn.pdf; Height: 0.838mm; Manufacturer_Part_Number: PTN1206E9903BST1
R31 R32 R37 R38 R43 R44 = CMP-2000-00874-1: Part Number: ERA-3AEB103V; Manufacturer: Panasonic
R45 R46 R49 R50 R53 R54 = CMP-1013-00510-2: Part Number: CRCW08051K00FKEA; Manufacturer: Vishay Dale
R47 R48 R51 R52 R55 R56 = TNPW04021K93BEED: Resistor; Manufacturer_Name: ROHM Semiconductor; Manufacturer_Part_Number: KTR10EZPF1694; Datasheet Link: http://rohmfs.rohm.com/en/products/databook/datasheet/passive/resistor/chip_resistor/ktr.pdf; Height: 0.65mm

## Sheet Strain In.SchDoc
size A4; SheetNumber: 8; SheetTotal: 9
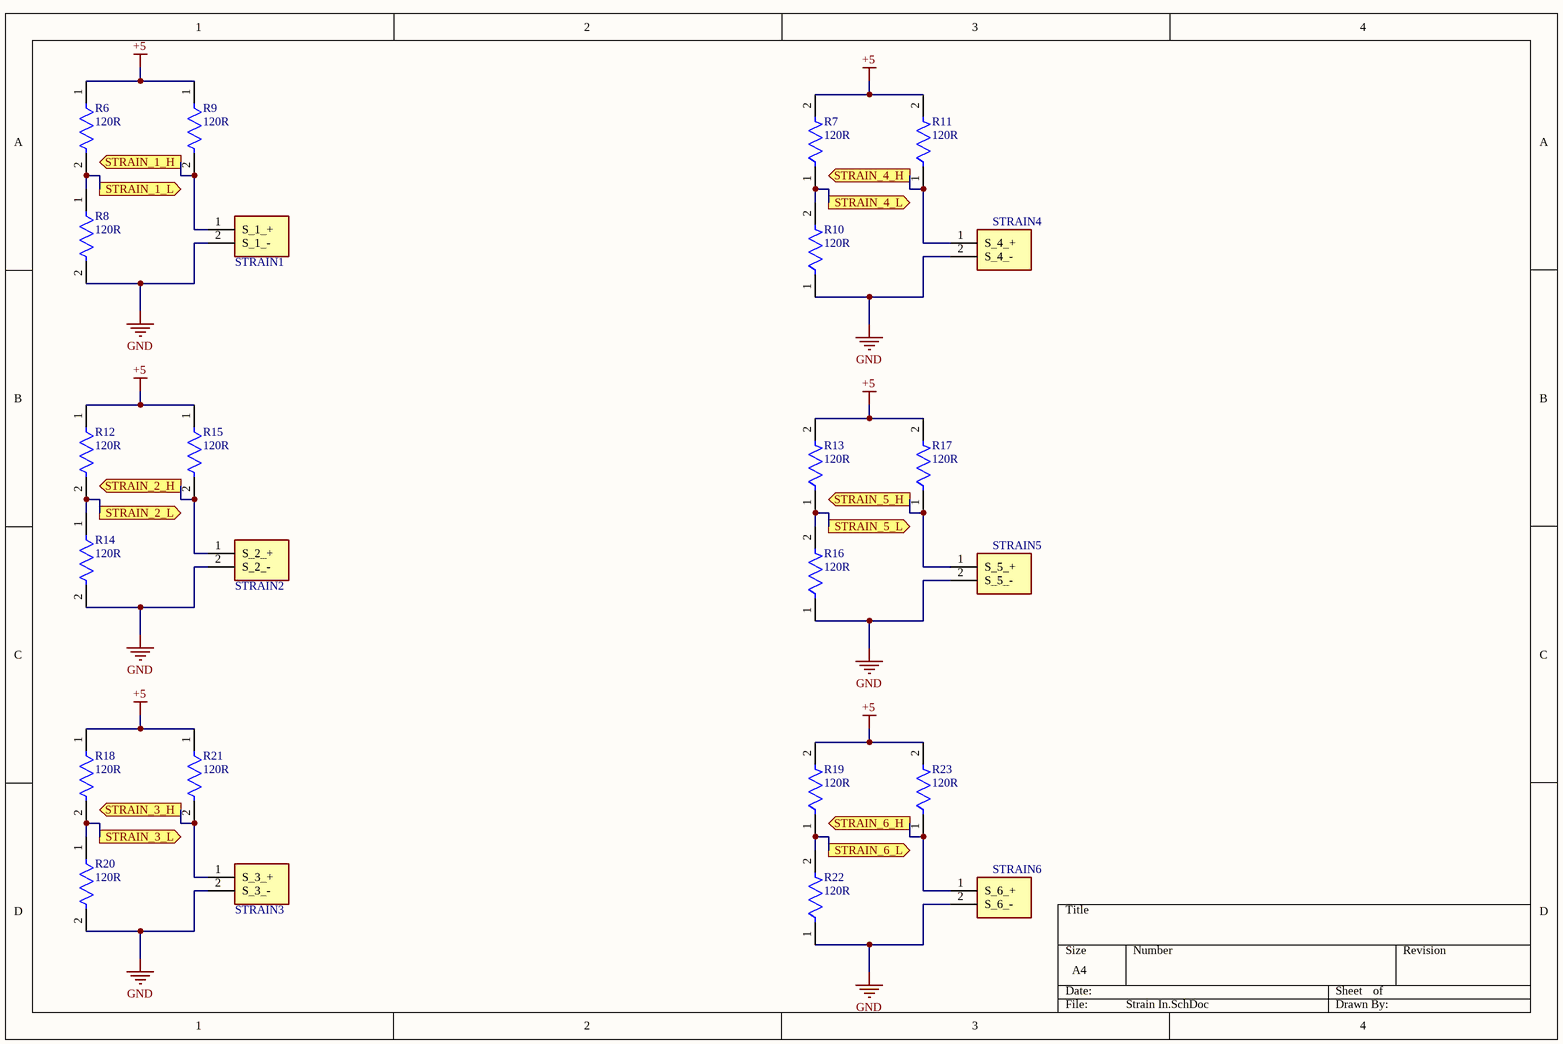
[diagram p7: Strain In.SchDoc]

### Parts
R6  120R  [FP-CRCW1206-e3-MFG]
R7  120R  [FP-CRCW1206-e3-MFG]
R8  120R  [FP-CRCW1206-e3-MFG]
R9  120R  [FP-CRCW1206-e3-MFG]
R10  120R  [FP-CRCW1206-e3-MFG]
R11  120R  [FP-CRCW1206-e3-MFG]
R12  120R  [FP-CRCW1206-e3-MFG]
R13  120R  [FP-CRCW1206-e3-MFG]
R14  120R  [FP-CRCW1206-e3-MFG]
R15  120R  [FP-CRCW1206-e3-MFG]
R16  120R  [FP-CRCW1206-e3-MFG]
R17  120R  [FP-CRCW1206-e3-MFG]
R18  120R  [FP-CRCW1206-e3-MFG]
R19  120R  [FP-CRCW1206-e3-MFG]
R20  120R  [FP-CRCW1206-e3-MFG]
R21  120R  [FP-CRCW1206-e3-MFG]
R22  120R  [FP-CRCW1206-e3-MFG]
R23  120R  [FP-CRCW1206-e3-MFG]
STRAIN1  171971-0002  [SHDR2W65P0X254_1X2_738X510X1216P]  (value not drawn)
STRAIN2  171971-0002  [SHDR2W65P0X254_1X2_738X510X1216P]  (value not drawn)
STRAIN3  171971-0002  [SHDR2W65P0X254_1X2_738X510X1216P]  (value not drawn)
STRAIN4  171971-0002  [SHDR2W65P0X254_1X2_738X510X1216P]  (value not drawn)
STRAIN5  171971-0002  [SHDR2W65P0X254_1X2_738X510X1216P]  (value not drawn)
STRAIN6  171971-0002  [SHDR2W65P0X254_1X2_738X510X1216P]  (value not drawn)

### Ports
STRAIN_1_H (out), STRAIN_1_L (out), STRAIN_2_H (out), STRAIN_2_L (out), STRAIN_3_H (out), STRAIN_3_L (out), STRAIN_4_H (out), STRAIN_4_L (out), STRAIN_5_H (out), STRAIN_5_L (out), STRAIN_6_H (out), STRAIN_6_L (out)

### Nets
+5: R6.1 R7.2 R9.1 R11.2 R12.1 R13.2 R15.1 R17.2 R18.1 R19.2 R21.1 R23.2
GND: R8.2 R10.1 R14.2 R16.1 R20.2 R22.1 STRAIN1.2(S_1_-) STRAIN2.2(S_2_-) STRAIN3.2(S_3_-) STRAIN4.2(S_4_-) STRAIN5.2(S_5_-) STRAIN6.2(S_6_-)
STRAIN_1_H: R9.2 STRAIN1.1(S_1_+) ; port STRAIN_1_H
STRAIN_1_L: R6.2 R8.1 ; port STRAIN_1_L
STRAIN_2_H: R15.2 STRAIN2.1(S_2_+) ; port STRAIN_2_H
STRAIN_2_L: R12.2 R14.1 ; port STRAIN_2_L
STRAIN_3_H: R21.2 STRAIN3.1(S_3_+) ; port STRAIN_3_H
STRAIN_3_L: R18.2 R20.1 ; port STRAIN_3_L
STRAIN_4_H: R11.1 STRAIN4.1(S_4_+) ; port STRAIN_4_H
STRAIN_4_L: R7.1 R10.2 ; port STRAIN_4_L
STRAIN_5_H: R17.1 STRAIN5.1(S_5_+) ; port STRAIN_5_H
STRAIN_5_L: R13.1 R16.2 ; port STRAIN_5_L
STRAIN_6_H: R23.1 STRAIN6.1(S_6_+) ; port STRAIN_6_H
STRAIN_6_L: R19.1 R22.2 ; port STRAIN_6_L

### Library data of the parts
R6-R23 = CMP-2003-04838-2: RES Thick Film, 120Ω, 1%, 0.25W, 100ppm/°C, 1206; Power Rating: 250mW; Voltage Rating: 200V; Length: 3.2mm; Tolerance: 1%; Weight: 0.000353oz; Temperature Coefficient: 100ppm/°C; Case/Package: 1206; Lead Free: Lead Free; Case Code (Metric): 3216; Min Operating Temperature: -55°C; Package Quantity: 10; Mount: Surface Mount; Height: 0.55mm; Packaging: Tape and Reel; Number of Terminations: 2; Composition: Thick Film; Width: 0.063inch; Voltage Rating (DC): 200V; Radiation Hardening: No; Contact Plating: Tin; Resistance: 120R; Case Code (Imperial): 1206; Termination: SMD/SMT; Max Power Dissipation: 250mW; Features: Automotive AEC-Q200; Military Standard: Not; Depth: 1.6mm; Max Operating Temperature: 155°C
STRAIN1-STRAIN6 = 171971-0002: Connector; Manufacturer_Name: Molex; Datasheet Link: https://componentsearchengine.com//171971-0002.pdf; Height: 12.16mm; Mouser2 Part Number: 538-171971-0002; Mouser2 Price/Stock: https://www.mouser.com/Search/Refine.aspx?Keyword=538-171971-0002; Manufacturer_Part_Number: 171971-0002

## Sheet NewThermocouple.SchDoc
size A4; SheetNumber: 9; SheetTotal: 9
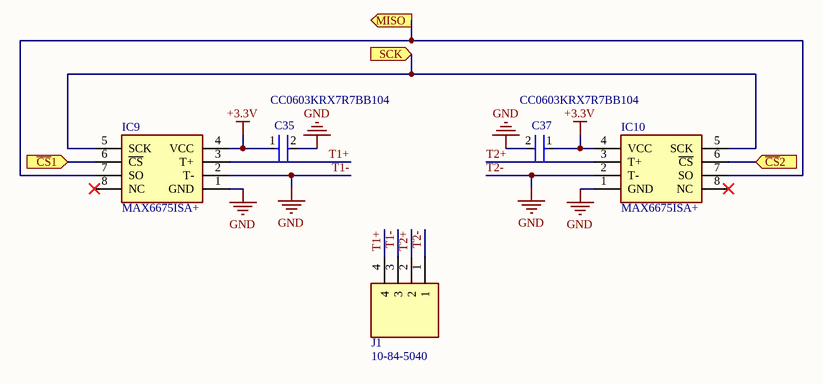
[diagram p8: NewThermocouple.SchDoc]

### Parts
C35  CC0603KRX7R7BB104  [FP-CC0603-DA-MFG]
C37  CC0603KRX7R7BB104  [FP-CC0603-DA-MFG]
IC9  MAX6675ISA+  [SOIC127P600X175-8N]
IC10  MAX6675ISA+  [SOIC127P600X175-8N]
J1  10-84-5040  [10845040]

### Ports
MISO (out), SCK (in), ~{CS}1 (in), ~{CS}2 (in)

### Nets
+3.3V: C35.1 C37.1 IC9.4(VCC) IC10.4(VCC)
GND: C35.2 C37.2 IC9.1(GND) IC9.2(T-) IC10.1(GND) IC10.2(T-) J1.1 J1.3  [also labelled T1-, T2-]
~{CS}1: IC9.6(~{CS}) ; port ~{CS}1
~{CS}2: IC10.6(~{CS}) ; port ~{CS}2
MISO: IC9.7(SO) IC10.7(SO) ; port MISO
SCK: IC9.5(SCK) IC10.5(SCK) ; port SCK
T1+: IC9.3(T+) J1.4
T2+: IC10.3(T+) J1.2

Not connected (* = marked no-connect by the designer): IC9 8(NC)*; IC10 8(NC)*

### Library data of the parts
C35 C37 = CMP-2000-05002-2: CAP CER 0.1UF 16V X7R 0603; Manufacturer: YAGEO; Tolerance: 0.1; Value: 100 nF; Temperature Coefficient: 15%; Material: Ceramic; Voltage Rating: 16 V; Package: CC0603-DA; ComponentLink2Description: Datasheet; Octopart: https://octopart.com/cc0603krx7r7bb104-yageo-192941; Temperature Range High: +125°C; Digikey Description: CAP CER 0.1UF 16V X7R 0603; Voltage: 16 V; Device Class L2: Capacitors; Height: 0.9mm; Temperature: -55°C to +125°C; Manufacturer Part Number: CC0603KRX7R7BB104; Device Class L1: Passive Components; Device Class L3: Ceramic Capacitors; ComponentLink2URL: http://www.yageo.com/documents/recent/UPY-GPHC_X7R_6.3V-to-50V_18.pdf; Footprint Url: http://www.yageo.com/exep/pages/download/literatures/UPY-C_GEN_24.pdf; RoHS: TRUE; Temperature Range Low: -55°C; Temperature Characteristic: X7R; Lead Free: Yes; Capacitance: 100 nF; Category: Cap; Mouser Description: Multilayer Ceramic Capacitor, CC Series, 0.1 - F, - 10%, X7R, 16 V, 0603 [1608 Metric]; Automotive: No
IC9 IC10 = MAX6675ISA+: Integrated Circuit; Manufacturer_Name: Maxim Integrated; Datasheet Link: https://componentsearchengine.com//MAX6675ISA+.pdf; Height: 1.75mm; Mouser2 Part Number: 700-MAX6675ISA; Mouser2 Price/Stock: https://www.mouser.com/Search/Refine.aspx?Keyword=700-MAX6675ISA; Manufacturer_Part_Number: MAX6675ISA+
J1 = 10-84-5040: Connector; Manufacturer_Name: Molex; Datasheet Link: https://www.molex.com/pdm_docs/sd/010845040_sd.pdf; Height: 14.22mm; Manufacturer_Part_Number: 10-84-5040

## Nets that join several sheets
+2.5: Power To Board (R34.1 R35.1), Strain To Digital (12 pins)
+3.3V: Power To Board (C39.2 V_REG_3V3.2), MCU (15 pins), CAN Bus (C15.1 C16.1 IC1.3), Debugger & I2C (Debug_Port.4), NewThermocouple (C35.1 C37.1 IC9.4 IC10.4)
+5: Power To Board (C36.2 R34.2 V_REG_5V.2), Debugger & I2C (I2C_PORT.1 R25.2 R26.2), Strain To Digital (12 pins), Strain In (12 pins)
GND: Top (ST1.1 ST4.1), Power To Board (8 pins), MCU (16 pins), Oscillator (C9.1 C10.1 X1.2 X1.4), CAN Bus (8 pins), Debugger & I2C (Debug_Port.6), Strain To Digital (18 pins), Strain In (12 pins), NewThermocouple (8 pins)
~{CS}1: MCU (MCU.30), NewThermocouple (IC9.6)
~{CS}2: MCU (MCU.27), NewThermocouple (IC10.6)
CAN_RX: MCU (MCU.32), CAN Bus (IC1.4)
CAN_TX: MCU (MCU.33), CAN Bus (IC1.1)
I2C_SCL: MCU (MCU.42), Debugger & I2C (I2C_PORT.3 R25.1)
I2C_SDA: MCU (MCU.43), Debugger & I2C (I2C_PORT.2 R26.1)
JTCLK/SWCLK: MCU (MCU.37), Debugger & I2C (Debug_Port.3)
JTDO/SWO: MCU (MCU.39), Debugger & I2C (Debug_Port.5)
JTMS/SWDIO: MCU (MCU.34), Debugger & I2C (Debug_Port.1)
MISO: MCU (MCU.16), NewThermocouple (IC9.7 IC10.7)
NRST: MCU (C13.1 MCU.7 R1.1 RESET.2), Debugger & I2C (Debug_Port.2)
OSC_IN: MCU (MCU.5), Oscillator (C10.2 X1.3)
OSC_OUT: MCU (MCU.6), Oscillator (C9.2 X1.1)
SCK: MCU (MCU.15), NewThermocouple (IC9.5 IC10.5)
STR1_IN: MCU (MCU.10), Strain To Digital (R45.2 R47.2)
STR2_IN: MCU (MCU.11), Strain To Digital (R49.2 R51.2)
STR3_IN: MCU (MCU.12), Strain To Digital (R53.2 R55.2)
STR4_IN: MCU (MCU.13), Strain To Digital (R46.2 R48.2)
STR5_IN: MCU (MCU.14), Strain To Digital (R50.2 R52.2)
STR6_IN: MCU (MCU.19), Strain To Digital (R54.2 R56.2)
STRAIN_1_H: Strain To Digital (IC2.3), Strain In (R9.2 STRAIN1.1)
STRAIN_1_L: Strain To Digital (IC2.2), Strain In (R6.2 R8.1)
STRAIN_2_H: Strain To Digital (IC6.3), Strain In (R15.2 STRAIN2.1)
STRAIN_2_L: Strain To Digital (IC6.2), Strain In (R12.2 R14.1)
STRAIN_3_H: Strain To Digital (IC8.3), Strain In (R21.2 STRAIN3.1)
STRAIN_3_L: Strain To Digital (IC8.2), Strain In (R18.2 R20.1)
STRAIN_4_H: Strain To Digital (IC3.3), Strain In (R11.1 STRAIN4.1)
STRAIN_4_L: Strain To Digital (IC3.2), Strain In (R7.1 R10.2)
STRAIN_5_H: Strain To Digital (IC5.3), Strain In (R17.1 STRAIN5.1)
STRAIN_5_L: Strain To Digital (IC5.2), Strain In (R13.1 R16.2)
STRAIN_6_H: Strain To Digital (IC7.3), Strain In (R23.1 STRAIN6.1)
STRAIN_6_L: Strain To Digital (IC7.2), Strain In (R19.1 R22.2)